# Altium schematic sheet Sheet1.SchDoc
size A4; SheetNumber: 1; SheetTotal: 2
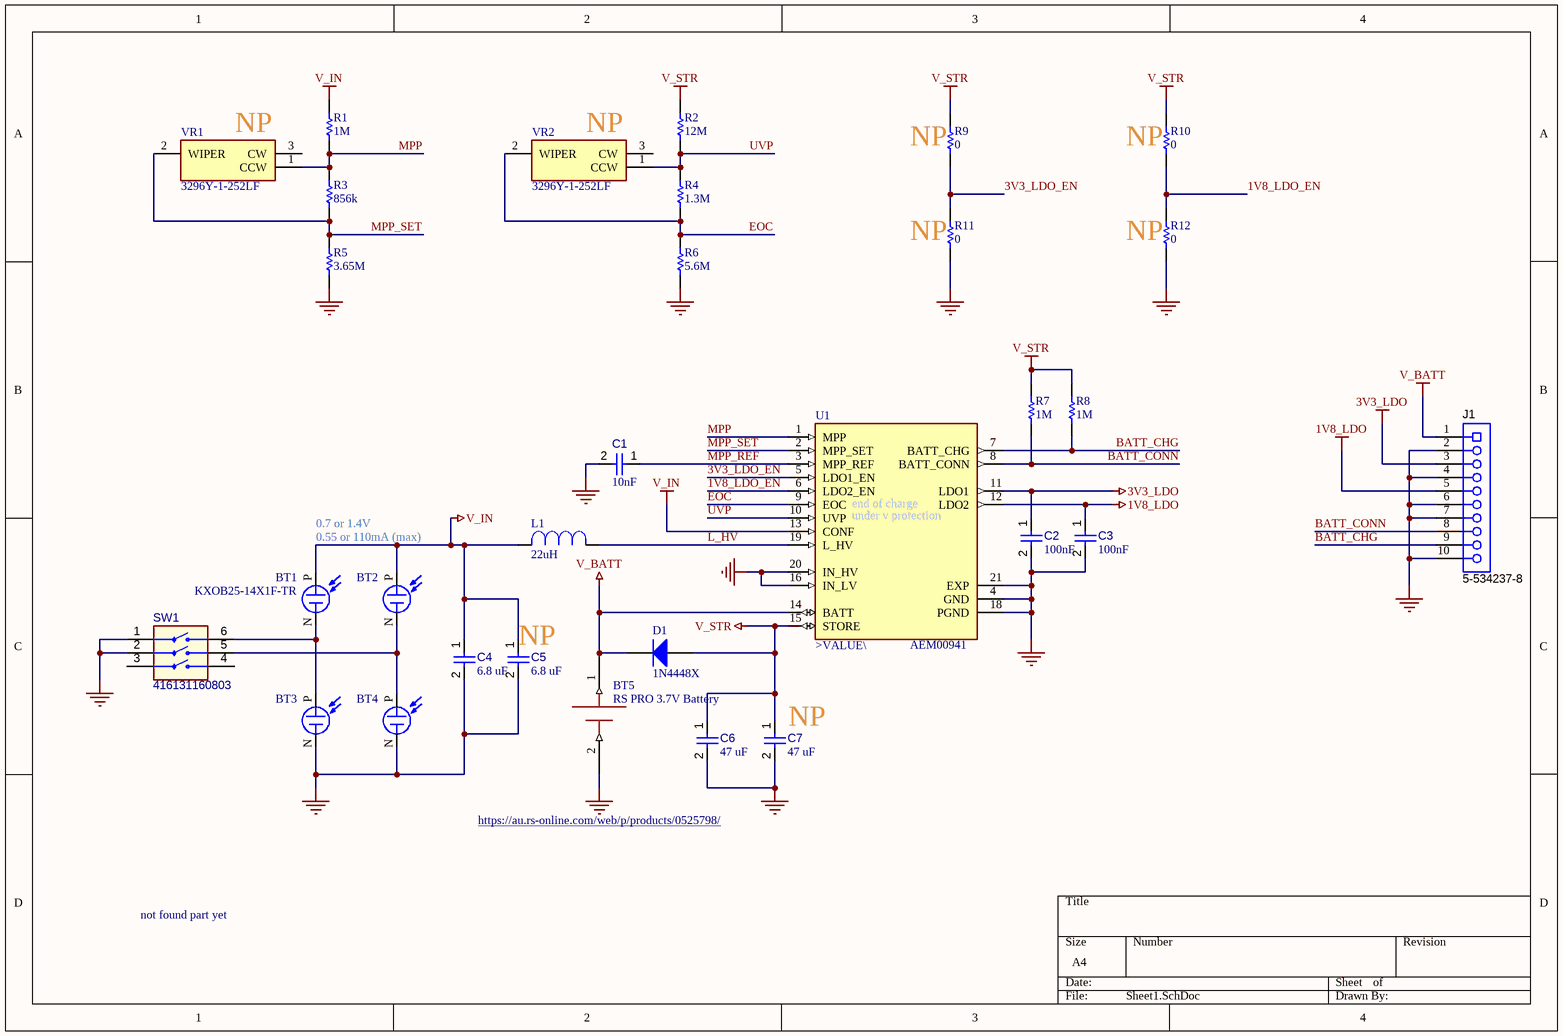
[diagram p0: Sheet1.SchDoc]

## Parts
BT1  KXOB25-14X1F-TR  [SOLAR_KXOB25-14X1F-TR]
BT2  KXOB25-14X1F-TR  [SOLAR_KXOB25-14X1F-TR]  (value not drawn)
BT3  KXOB25-14X1F-TR  [SOLAR_KXOB25-14X1F-TR]  (value not drawn)
BT4  KXOB25-14X1F-TR  [SOLAR_KXOB25-14X1F-TR]  (value not drawn)
BT5  RS PRO 3.7V Battery
C1  value 10nF  [CAPC1608X94X35NL15T15]  (hidden comment: Capacitor 1 uF +/- 10% 16 V 0603)
C2  value 100nF  [CAPC1608X94X35NL15T15]  (hidden comment: Capacitor 1 uF +/- 10% 16 V 0603)
C3  value 100nF  [CAPC1608X94X35NL15T15]  (hidden comment: Capacitor 1 uF +/- 10% 16 V 0603)
C4  value 6.8 uF  [CAPC0805(2012)145_L]  (hidden comment: Capacitor 100µF +/-20% 6.3V 0805)
C5  value 6.8 uF  [CAPC0805(2012)145_L]  (hidden comment: Capacitor 100µF +/-20% 6.3V 0805)
C6  value 47 uF  [CAPC0805(2012)145_L]  (hidden comment: Capacitor 100µF +/-20% 6.3V 0805)
C7  value 47 uF  [CAPC0805(2012)145_L]  (hidden comment: Capacitor 100µF +/-20% 6.3V 0805)
D1  1N4448X  [FAIR-SOD-323_V]
J1  5-534237-8  [TECO-5-534237-8_V]
L1  22uH  [INDM125125X600N]
R1  value 1M  [RESC1608X55X25ML10T15]  (hidden comment: Resistor 0R +/- 5% 0603 100 mW)
R2  value 12M  [RESC1608X55X25ML10T15]  (hidden comment: Resistor 0R +/- 5% 0603 100 mW)
R3  value 856k  [RESC1608X55X25ML10T15]  (hidden comment: Resistor 0R +/- 5% 0603 100 mW)
R4  value 1.3M  [RESC1608X55X25ML10T15]  (hidden comment: Resistor 0R +/- 5% 0603 100 mW)
R5  value 3.65M  [RESC1608X55X25ML10T15]  (hidden comment: Resistor 0R +/- 5% 0603 100 mW)
R6  value 5.6M  [RESC1608X55X25ML10T15]  (hidden comment: Resistor 0R +/- 5% 0603 100 mW)
R7  value 1M  [RESC1608X55X25ML10T15]  (hidden comment: Resistor 0R +/- 5% 0603 100 mW)
R8  value 1M  [RESC1608X55X25ML10T15]  (hidden comment: Resistor 0R +/- 5% 0603 100 mW)
R9  value 0  [RESC1005X40X25ML05T10]  (hidden comment: Resistor 0R 0402 63 mW)
R10  value 0  [RESC1005X40X25ML05T10]  (hidden comment: Resistor 0R 0402 63 mW)
R11  value 0  [RESC1005X40X25ML05T10]  (hidden comment: Resistor 0R 0402 63 mW)
R12  value 0  [RESC1005X40X25ML05T10]  (hidden comment: Resistor 0R 0402 63 mW)
SW1  416131160803  [416131160803]
U1  AEM00941  [QFN40P300X300X100-21N]
VR1  3296Y-1-252LF  [3296Y_1]
VR2  3296Y-1-252LF  [3296Y_1]

## Nets
1V8_LDO: C3.1 J1.5 U1.12(LDO2)
3V3_LDO: C2.1 J1.3 U1.11(LDO1)
GND: BT3.N BT4.N BT5.2(BATT_NEG) C1.2 C2.2 C3.2 C4.2 C5.2 C6.2 C7.2 J1.2 J1.4 J1.6 J1.7 J1.10 R5.1 R6.1 R11.1 R12.1 SW1.1 SW1.2 U1.4(GND) U1.16(IN_LV) U1.18(PGND) U1.20(IN_HV) U1.21(EXP)
V_BATT: BT5.1(BATT_POS) D1.2(K) J1.1 U1.14(BATT)
V_IN: BT1.P BT2.P C4.1 C5.1 L1.2 R1.2 U1.13(CONF)
V_STR: C6.1 C7.1 D1.1(A) R2.2 R7.2 R8.2 R9.2 R10.2 U1.15(STORE)
1V8_LDO_EN: R10.1 R12.2 U1.6(LDO2_EN)
3V3_LDO_EN: R9.1 R11.2 U1.5(LDO1_EN)
BATT_CHG: J1.9 R8.1 U1.7(BATT_CHG)
BATT_CONN: J1.8 R7.1 U1.8(BATT_CONN)
EOC: R4.1 R6.2 U1.9(EOC) VR2.2(WIPER)
L_HV: L1.1 U1.19(L_HV)
MPP: R1.1 R3.2 U1.1(MPP) VR1.1(CCW)
MPP_REF: C1.1 U1.3(MPP_REF)
MPP_SET: R3.1 R5.2 U1.2(MPP_SET) VR1.2(WIPER)
UVP: R2.1 R4.2 U1.10(UVP) VR2.1(CCW)
NetBT1_N: BT1.N BT3.P SW1.6
NetBT2_N: BT2.N BT4.P SW1.5

Not connected (* = marked no-connect by the designer): SW1 3 4; VR1 3(CW); VR2 3(CW)

## Notes on the sheet
- (near VR1) NP
- (near VR2) NP
- (near R9) NP
- (near R10) NP
- (near R11) NP
- (near R12) NP
- (near U1) end of charge
- (near U1) under v protection
- 0.7 or 1.4V
- 0.55 or 110mA (max)
- (near C5) NP
- (near C7) NP
- https://au.rs-online.com/web/p/products/0525798/
- not found part yet
- (in symbol SPV1050TTR) >VALUE\

## Library data of the parts
BT1-BT4 = KXOB25-14X1F-TR: Monocrystalline Solar Cell 30.7 mW 690 mV; MF: ANYSOLAR Ltd; SnapEDA_Link: https://www.snapeda.com/parts/KXOB25-14X1F-TR/Sola/view-part/?ref=snap; Package: None; Value: *; MP: KXOB25-14X1F-TR; Check_prices: https://www.snapeda.com/parts/KXOB25-14X1F-TR/Sola/view-part/?ref=eda
C1-C3 = CMP-001-00003-6: Chip Capacitor, 1 uF, +/- 10%, 16 V, 0603 (1608 Metric); Voltage Rating: 16V; Capacitor Type: Ceramic; Max Operating Temperature: 125°C; Pins: 2; Tolerance: 10%; Min Operating Temperature: -55°C; RoHS Compliant: True; Mounting Technology: SM; Case/Package: 0603
C4-C7 = CMP-001-00054-4: Chip Capacitor, 100µF +/-20%, 6.3V, 0805, Thickness 1.45 mm; Tolerance: 10%; Min Operating Temperature: -55°C; Max Operating Temperature: 85°C; Pins: 2; Mounting Technology: SMT; Case/Package: 0805; Voltage Rating: 6.3V
D1 = CMP-004-00001-2: Small Signal Diode, 75 V, 0.15 A, -55 to 150 degC, 2-Pin SOD-323, RoHS, Tape and Reel; Manufacturer: Fairchild; Recovery Time: 4ns; Forward Voltage: 1V; Peak Reverse Current: 5uA; Forward Current: 150mA; Capacitance: -323f; Datasheet URL: https://www.fairchildsemi.com/datasheets/1N/1N4148WS.pdf; Package Reference: SOD-323; Package Description: 2-Pin Small Outline Diode Flat Lead, Body 1.7 x 1.25 mm; Case/Package: SOD-323; Mounting Technology: SM; Manufacturer URL: https://www.fairchildsemi.com/; Pins: 2; Packaging: TapeandReel; Package Quantity: 3000; Min Operating Temperature: -55°C; RoHS Compliant: True; Max Operating Temperature: 150°C; Datasheet Version: Rev. 1.2, 03/2015
J1 = CMP-002-00019-2: Female Receptacle, Pitch 2.54 mm, 1 x 10 Position, Height 8.64 mm, Tail Length 2.92 mm, -65 to 105 degC, RoHS, Tube; Manufacturer: TE Connectivity; Max Contact Resistance: 12mohm; Connector Type: Header; Current Rating: 2A; Voltage Rating: 750V; Rows: 1; Datasheet Version: Apr-13; Contact Plating: Gold; Min Operating Temperature: -65°C; Manufacturer URL: http://www.te.com/; Mounting Technology: TH; Contact Material: Bronze; RoHS Compliant: True; Packaging: Rail/Tube; Contact Finish: Gold; Pins: 10; Case/Package: 5-534237-8; Max Operating Temperature: 105°C; Lead Pitch: 2.54mm; Gender: Female; Package Quantity: 22; Colour: Black; Package Description: Female Receptacle, Pitch 2.54 mm, 1 x 10 Position, Height 8.64 mm, Tail Length 2.92 mm; Package Reference: 5-534237-8; Datasheet URL: http://www.te.com/commerce/DocumentDelivery/DDEController?Action=showdoc&DocId=Customer+Drawing%7F534237%7FR5%7Fpdf%7FEnglish%7FENG_CD_534237_R5.pdf%7F5-534237-8
L1 = DR125-471-R: INDUCTOR, SHIELDED, 470UH, 1.02A, SMD; Product Range:COILTRONICS - DR125 Series; Inductance:470ÂµH; Inductance Tolerance:Â± 20%; Inductor Construction:Shielded; DC Resistance Max:-; RMS Current (Irms):870mA; Packaging:Cut Tape; MF: Eaton; MP: DR125471R; SnapEDA_Link: https://www.snapeda.com/parts/DR125471R/Eaton/view-part/?ref=snap; Package: Non Standard Coiltronics / Eaton; Value: *; Check_prices: https://www.snapeda.com/parts/DR125471R/Eaton/view-part/?ref=eda
R1-R8 = CMP-009-00006-5: Chip Resistor, 0 Ohm, 0.1 W, -55 to 155 degC, 0603 (1608 Metric); Power: 100mW; Voltage Rating: 50V; Max Operating Temperature: 155°C; RoHS Compliant: True; Mounting Technology: SM; Case/Package: 0603; Min Operating Temperature: -55°C; Tolerance: 5%; Pins: 2
R9-R12 = CMP-009-00004-5: Chip Resistor, 0 Ohm, 0.063 W, -55 to 155 degC, 0402 (1005 Metric); Power: 63mW; Voltage Rating: 50V; Max Operating Temperature: 155°C; Pins: 2; RoHS Compliant: True; Min Operating Temperature: -55°C; Mounting Technology: SM; Case/Package: 0402
SW1 = CMP-011-00012-3: WS-DISV 1.27 mm small compact SMD Dip Switch with top tape; ComponentLink1Description: Manufacturer URL; ComponentLink2Description: Datasheet; ComponentLink2URL: http://katalog.we-online.de/em/datasheet/4161311608xx.pdf; Pins: 6; ComponentLink1URL: http://www.we-online.com
U1 = SPV1050TTR: Charger IC Multi-Chemistry 20-VFQFPN (3x3); MF: STMicroelectronics; SnapEDA_Link: https://www.snapeda.com/parts/SPV1050TTR/STMicroelectronics/view-part/?ref=snap; Package: VFQFN-20 STMicroelectronics; Value: *; MP: SPV1050TTR; Check_prices: https://www.snapeda.com/parts/SPV1050TTR/STMicroelectronics/view-part/?ref=eda
VR1 VR2 = 3296Y-1-252LF: Variable Resistor; Manufacturer_Name: Bourns; Datasheet Link: https://datasheet.datasheetarchive.com/originals/distributors/SFDatasheet-6/sf-000139911.pdf; Manufacturer_Part_Number: 3296Y-1-252LF; Mouser Part Number: 652-3296Y-1-252LF; Mouser Price/Stock: https://www.mouser.co.uk/ProductDetail/Bourns/3296Y-1-252LF?qs=eK3J1aEiRPuCAxSfNwIyLg%3D%3D; Arrow Part Number: 3296Y-1-252LF; Arrow Price/Stock: https://www.arrow.com/en/products/3296y-1-252lf/bourns